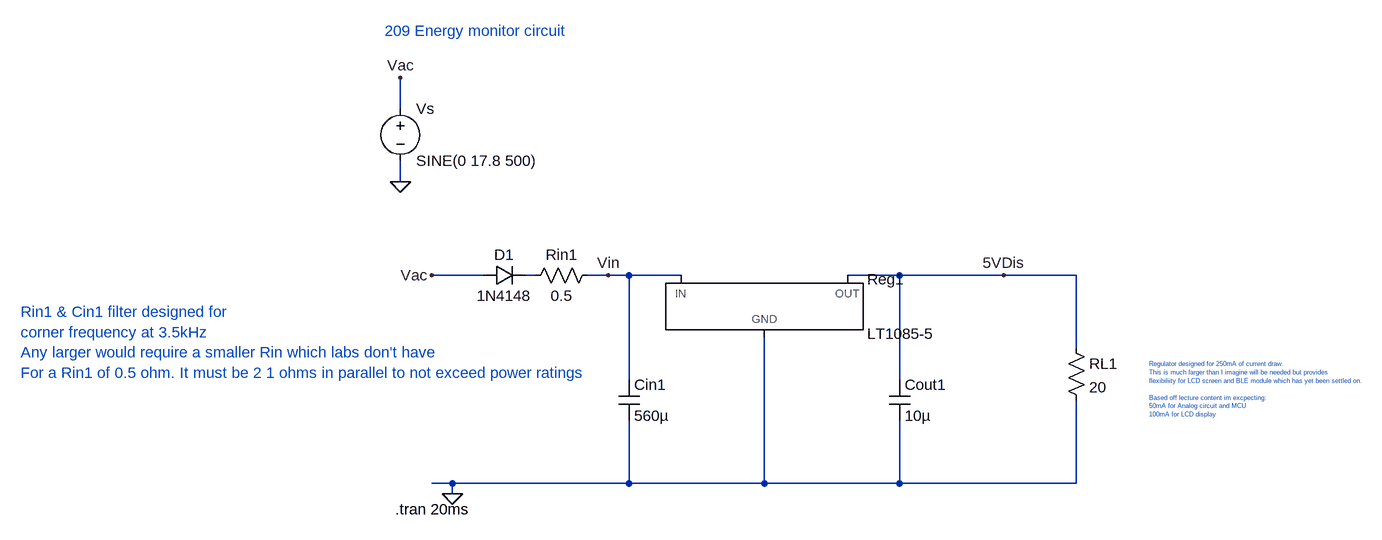
[diagram p0: schematic energy_monitor_simulation.asc]
energy_monitor_simulation.asc, the LTspice schematic file:
Version 4.1
SHEET 1 1540 840
WIRE 32 176 32 128
WIRE 32 288 32 256
WIRE 160 432 80 432
WIRE 240 432 224 432
WIRE 352 432 320 432
WIRE 384 432 352 432
WIRE 464 432 384 432
WIRE 800 432 720 432
WIRE 960 432 800 432
WIRE 1072 432 960 432
WIRE 1072 544 1072 432
WIRE 384 592 384 432
WIRE 800 592 800 432
WIRE 112 752 80 752
WIRE 384 752 384 656
WIRE 384 752 112 752
WIRE 592 752 592 528
WIRE 592 752 384 752
WIRE 800 752 800 656
WIRE 800 752 592 752
WIRE 1072 752 1072 624
WIRE 1072 752 800 752
WIRE 112 768 112 752
FLAG 112 768 0
FLAG 80 432 Vac
FLAG 960 432 5VDis
FLAG 352 432 Vin
FLAG 32 288 0
FLAG 32 128 Vac
DATAFLAG 384 432 ""
SYMBOL voltage 32 160 R0
WINDOW 123 0 0 Left 0
WINDOW 39 0 0 Left 0
SYMATTR InstName Vs
SYMATTR Value SINE(0 17.8 500)
SYMBOL PowerProducts/LT1085-5 592 432 R0
SYMATTR InstName Reg1
SYMBOL res 1056 528 R0
SYMATTR InstName RL1
SYMATTR Value 20
SYMBOL res 336 416 R90
WINDOW 0 0 56 VBottom 2
WINDOW 3 32 56 VTop 2
SYMATTR InstName Rin1
SYMATTR Value 0.5
SYMBOL diode 160 448 R270
WINDOW 0 32 32 VTop 2
WINDOW 3 0 32 VBottom 2
SYMATTR InstName D1
SYMATTR Value 1N4148
SYMBOL cap 368 592 R0
SYMATTR InstName Cin1
SYMATTR Value 560µ
SYMATTR SpiceLine Rser=0.001
SYMBOL cap 784 592 R0
SYMATTR InstName Cout1
SYMATTR Value 10µ
SYMATTR SpiceLine Rser=0.001
TEXT 8 56 Left 2 ;209 Energy monitor circuit
TEXT 24 792 Left 2 !.tran 20ms
TEXT 1184 568 Left 0 ;Regulator designed for 250mA of current draw. \nThis is much larger than I imagine will be needed but provides \nflexibiliity for LCD screen and BLE module which has yet been settled on.\n \nBased off lecture content im excpecting: \n50mA for Analog circuit and MCU\n100mA for LCD display
TEXT -552 488 Left 2 ;Rin1 & Cin1 filter designed for \ncorner frequency at 3.5kHz\nAny larger would require a smaller Rin which labs don't have\nFor a Rin1 of 0.5 ohm. It must be 2 1 ohms in parallel to not exceed power ratings

The netlist it stands for:
* energy_monitor_simulation.asc
Vs Vac 0 SINE(0 17.8 500)
X§Reg1 0 5VDis Vin LT1085-5  ; pins GND OUT IN
RL1 5VDis 0 20
Rin1 Vin N001 0.5
D1 Vac N001 1N4148
Cin1 Vin 0 560µ Rser=0.001
Cout1 5VDis 0 10µ Rser=0.001
.model D D
.lib standard.dio
* 209 Energy monitor circuit
.tran 20ms
* Regulator designed for 250mA of current draw.
* This is much larger than I imagine will be needed but provides
* flexibiliity for LCD screen and BLE module which has yet been settled on.
* Based off lecture content im excpecting:
* 50mA for Analog circuit and MCU
* 100mA for LCD display
* Rin1 & Cin1 filter designed for
* corner frequency at 3.5kHz
* Any larger would require a smaller Rin which labs don't have
* For a Rin1 of 0.5 ohm. It must be 2 1 ohms in parallel to not exceed power ratings
.backanno
.end